# Altium schematic sheet ExternalConnections.SchDoc
size Letter
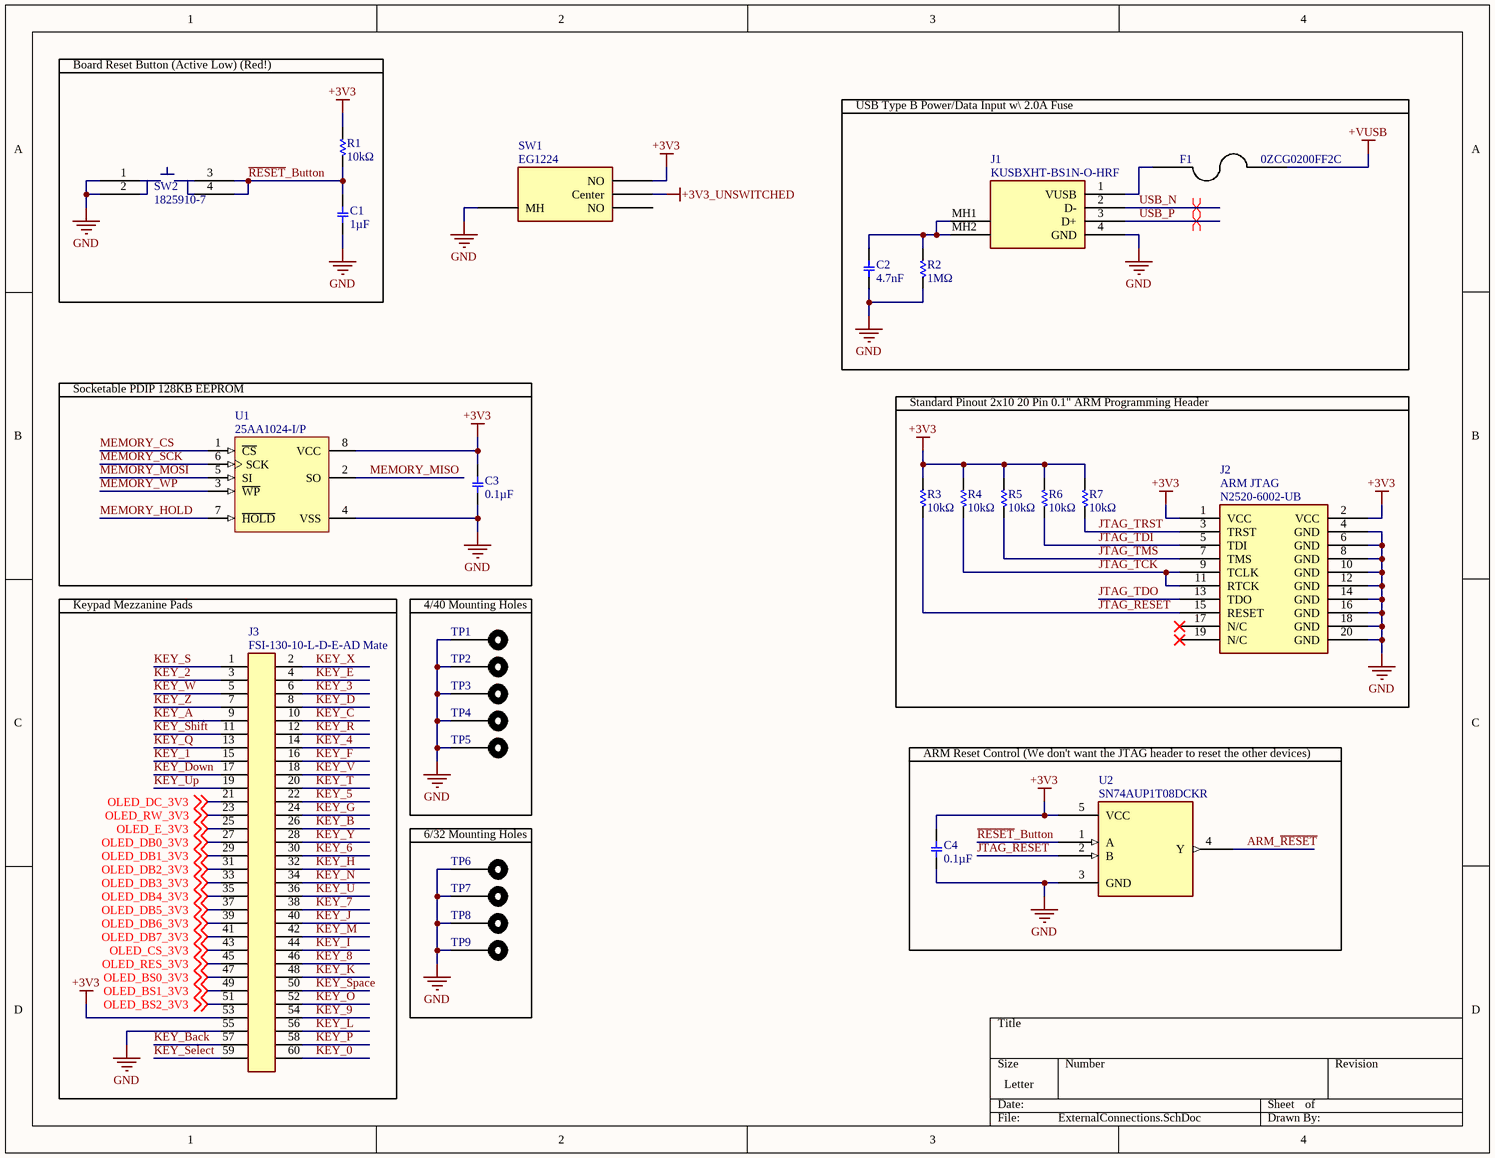
[diagram p0: ExternalConnections.SchDoc]

## Parts
C1  1µF  [C0805(2012)_NP_med]
C2  4.7nF  [C0805(2012)_NP_med]
C3  0.1µF  [C0805(2012)_NP_med]
C4  0.1µF  [C0805(2012)_NP_med]
F1  Manufacturer Part Number: 0ZCG0200FF2C  [C1812(4532)_NP_med]  (hidden comment: Bel 0ZCG0200FF2C)
J1  KUSBXHT-BS1N-O-HRF  [Kycon KUSBXHT-BS1N-O-HRF]
J2  ARM JTAG  Manufacturer Part Number: N2520-6002-UB  [3M 2520-6002UB]
J3  FSI-130-10-L-D-E-AD Mate  [FSI-130-10-L-D-E-AD - Mate]  (no BOM)
R1  10kΩ  [R0805(2012)_med]
R2  1MΩ  [R0805(2012)_med]
R3  10kΩ  [R0805(2012)_med]
R4  10kΩ  [R0805(2012)_med]
R5  10kΩ  [R0805(2012)_med]
R6  10kΩ  [R0805(2012)_med]
R7  10kΩ  [R0805(2012)_med]
SW1  Manufacturer Part Number: EG1224  [E-Switch EG1224]  (hidden comment: E-Switch EG1224)
SW2  1825910-7  [TE 1825910-6]
TP1  Testpoint  [4-40 HOLE]  (value not drawn)
TP2  Testpoint  [4-40 HOLE]  (value not drawn)
TP3  Testpoint  [4-40 HOLE]  (value not drawn)
TP4  Testpoint  [4-40 HOLE]  (value not drawn)
TP5  Testpoint  [4-40 HOLE]  (value not drawn)
TP6  Testpoint  [6-32 Hole]  (value not drawn)
TP7  Testpoint  [6-32 Hole]  (value not drawn)
TP8  Testpoint  [6-32 Hole]  (value not drawn)
TP9  Testpoint  [6-32 Hole]  (value not drawn)
U1  25AA1024-I/P  [PDIP300-P8]
U2  Manufacturer Part Number: SN74AUP1T08DCKR  [TI 5 Pin DCK (R-PDSO-G5)]  (hidden comment: TI SN74AUP1T08DCKR)

## Blocks framed on the sheet
Board Reset Button (Active Low) (Red!): C1 R1 SW2
USB Type B Power/Data Input w\ 2.0A Fuse: C2 F1 J1 R2
Socketable PDIP 128KB EEPROM: C3 U1
Standard Pinout 2x10 20 Pin 0.1" ARM Programming Header: J2 R3-R7
Keypad Mezzanine Pads: J3
4/40 Mounting Holes: TP1-TP5
6/32 Mounting Holes: TP6-TP9

## Nets
+3V3: C3.1 C4.1 J2.1(VCC) J2.2(VCC) J3.53 R1.1 R3.1 R4.1 R5.1 R6.1 R7.1 SW1.1(NO) U1.8(VCC) U2.5(VCC)
+3V3_UNSWITCHED: SW1.2(Center)
+VUSB: F1.2
GND: C1.2 C2.2 C3.2 C4.2 J1.4(GND) J2.4(GND) J2.6(GND) J2.8(GND) J2.10(GND) J2.12(GND) J2.14(GND) J2.16(GND) J2.18(GND) J2.20(GND) J3.55 R2.2 SW1.4(MH) SW2.1 SW2.2 TP1.1 TP2.1 TP3.1 TP4.1 TP5.1 TP6.1 TP7.1 TP8.1 TP9.1 U1.4(VSS) U2.3(GND)
ARM_~{RESET}: U2.4(Y)
JTAG_~{RESET}: J2.15(RESET) R3.2 U2.2(B)
JTAG_TCK: J2.9(TCLK) J2.11(RTCK) R4.2
JTAG_TDI: J2.5(TDI) R6.2
JTAG_TDO: J2.13(TDO)
JTAG_TMS: J2.7(TMS) R5.2
JTAG_TRST: J2.3(TRST) R7.2
KEY_0: J3.60
KEY_1: J3.15
KEY_2: J3.3
KEY_3: J3.6
KEY_4: J3.14
KEY_5: J3.22
KEY_6: J3.30
KEY_7: J3.38
KEY_8: J3.46
KEY_9: J3.54
KEY_A: J3.9
KEY_B: J3.26
KEY_Back: J3.57
KEY_C: J3.10
KEY_D: J3.8
KEY_Down: J3.17
KEY_E: J3.4
KEY_F: J3.16
KEY_G: J3.24
KEY_H: J3.32
KEY_I: J3.44
KEY_J: J3.40
KEY_K: J3.48
KEY_L: J3.56
KEY_M: J3.42
KEY_N: J3.34
KEY_O: J3.52
KEY_P: J3.58
KEY_Q: J3.13
KEY_R: J3.12
KEY_S: J3.1
KEY_Select: J3.59
KEY_Shift: J3.11
KEY_Space: J3.50
KEY_T: J3.20
KEY_U: J3.36
KEY_Up: J3.19
KEY_V: J3.18
KEY_W: J3.5
KEY_X: J3.2
KEY_Y: J3.28
KEY_Z: J3.7
MEMORY_CS: U1.1(~{CS})
MEMORY_HOLD: U1.7(~{HOLD})
MEMORY_MISO: U1.2(SO)
MEMORY_MOSI: U1.5(SI)
MEMORY_SCK: U1.6(SCK)
MEMORY_WP: U1.3(~{WP})
OLED_BS0_3V3: J3.47 ; off-sheet OLED_BS0_3V3
OLED_BS1_3V3: J3.49 ; off-sheet OLED_BS1_3V3
OLED_BS2_3V3: J3.51 ; off-sheet OLED_BS2_3V3
OLED_CS_3V3: J3.43 ; off-sheet OLED_CS_3V3
OLED_DB0_3V3: J3.27 ; off-sheet OLED_DB0_3V3
OLED_DB1_3V3: J3.29 ; off-sheet OLED_DB1_3V3
OLED_DB2_3V3: J3.31 ; off-sheet OLED_DB2_3V3
OLED_DB3_3V3: J3.33 ; off-sheet OLED_DB3_3V3
OLED_DB4_3V3: J3.35 ; off-sheet OLED_DB4_3V3
OLED_DB5_3V3: J3.37 ; off-sheet OLED_DB5_3V3
OLED_DB6_3V3: J3.39 ; off-sheet OLED_DB6_3V3
OLED_DB7_3V3: J3.41 ; off-sheet OLED_DB7_3V3
OLED_DC_3V3: J3.21 ; off-sheet OLED_DC_3V3
OLED_E_3V3: J3.25 ; off-sheet OLED_E_3V3
OLED_RES_3V3: J3.45 ; off-sheet OLED_RES_3V3
OLED_RW_3V3: J3.23 ; off-sheet OLED_RW_3V3
~{RESET}_Button: C1.1 R1.2 SW2.3 SW2.4 U2.1(A)
USB_N: J1.2(D-)
USB_P: J1.3(D+)
NetC2_1: C2.1 J1.MH1 J1.MH2 R2.1
NetF1_1: F1.1 J1.1(VUSB)

Not connected (* = marked no-connect by the designer): J2 17(N/C)* 19(N/C)*; SW1 3(NO)

## Layout directives
differential pair: USB_N, USB_P

## Notes on the sheet
- ARM Reset Control (We don't want the JTAG header to reset the other devices)

## Library data of the parts
C1-C4 = CPN_SMT: SMT Capacitor; Tolerance: X7R; Rating: 16v
  C1: Value: 1µF
  C2: Value: 4.7nF
  C3 C4: Value: 0.1µF
F1 = Bel 0ZCG0200FF2C: PTC RESTTBLE 2.0A 8V CHIP 1812; Manufacturer: Bel Fuse Inc.; Current - Max: 100A; Current - Hold (Ih) (Max): 2A; Current - Trip (It): 3.5A; R Min/Max: 0.020 ~ 0.070 Ohm; Time to Trip: 2s; Supplier 1: Digi-Key; RoHS: RoHS Compliant; Category: Circuit Protection; Stock 1: 4721; Pricing 1: 1=0.18, 10=0.169, 25=0.156, 100=0.1401, 250=0.12476, 500=0.10396, 1000=0.09851 (USD); Packaging: Cut Tape (CT); Voltage - Max: 8V; Package / Case: 1812 (4532 Metric), Concave; ComponentLink1URL: http://www.belfuse.com/pdfs/0ZCG.pdf; ComponentLink1Description: http://www.belfuse.com/pdfs/0ZCG.pdf; Supplier Part Number 1: 507-1777-1-ND
J1 = Kycon KUSBXHT-BS1N-O-HRF: TYPE B ORANGE HIGH TEMP/RETENTION; Manufacturer: Kycon; Connector Type: USB Type B Receptacle; Current Rating: 1 A; Gender: Female; Mounting Angle: Right; Number of Contacts: 4 Contact; Voltage Rating: 30 VAC; Number of Ports: 1 Port; Insulation Resistance: 1000 MOhms; Supplier 1: Mouser; Manufacturer Part Number: KUSBXHT-BS1N-O-HRF; RoHS: RoHS Compliant; Category: USB Connectors; Stock 1: 2882; Pricing 1: 1=2.06, 25=1.73, 100=1.51, 500=1.34, 1000=1.20, 5000=1.11, 10000=1.02 (USD); Color: Orange; Contact Plating: Gold; Operating Temperature Range: - 25 C to + 80 C; Packaging: Tray; Product: USB Type B Connectors; Series: KUSBXHT; Termination Style: Solder; Brand: Kycon; Contact Material: Phosphor Bronze; Flammability Rating: UL 94 V-0; Insulator Color: Orange; Product Category: USB Connectors; Standard: USB; Standard Pack Qty: 36; RoHS - Mouser: Y; Minimum Order Quantity: 1; Reeling: False; ComponentLink1URL: http://www.mouser.com/ds/2/222/KUSBX-371999.pdf; ComponentLink1Description: http://www.mouser.com/ds/2/222/KUSBX-371999.pdf
J2 = 20-Pin ARM JTAG Programming Header: Standard 20-Pin Pinout; Manufacturer: 3M; Connector Type: Header, Shrouded; Number of Positions: 20; Number of Positions Loaded: All; Pitch: 0.100" (2.54mm); Supplier 1: Digi-Key; RoHS: RoHS Compliant; Category: Connectors, Interconnects; Stock 1: 0; Pricing 1: 1008=2.059 (USD); Packaging: Bulk; Contact Type: Male Pin; Number of Rows: 2; Row Spacing: 0.100" (2.54mm); Contact Mating Length: 0.243" (6.17mm); Mounting Type: Through Hole; Termination: Solder; Fastening Type: -; Features: -; Contact Finish: Gold; Contact Finish Thickness: 30µin (0.76µm); Color: Black; ComponentLink1URL: http://multimedia.3m.com/mws/mediawebserver?66666UuZjcFSLXTtMXM6MxfcEVuQEcuZgVs6EVs6E666666--; ComponentLink1Description: http://multimedia.3m.com/mws/mediawebserver?66666UuZjcFSLXTtMXM6MxfcEVuQEcuZgVs6EVs6E666666--
J3 = Samtec FSI-130-10-L-D-E-AD Mate: CONN INTERFACE ONE PC 1MM 60POS
R1-R7 = RES_SMT: SMT resistor; Tolerance: 1%
  R1 R3-R7: Value: 10kΩ
  R2: Value: 1MΩ
SW1 = E-Switch EG1224: SWITCH SLIDE SPDT 500MA 15V; Contact Timing: Non-Shorting (BBM); Switch Function: On-On; Current Rating: 500mA (DC); Actuator Type: Standard; Actuator Length: 8.50mm; Switch Travel: 4.00mm; Operating Force: 250gf; Supplier 1: Digi-Key; Manufacturer: E-Switch; RoHS: RoHS Compliant; Category: Switches; Stock 1: 3595; Pricing 1: 1=0.73, 10=0.698, 25=0.684, 50=0.6112, 100=0.582, 250=0.56744, 500=0.48016, 1000=0.4656 (USD); Packaging: Bulk; Circuit: SPDT; Voltage Rating - AC: -; Voltage Rating - DC: 15V; Contact Material: Copper Alloy; Contact Finish: Silver; Mounting Type: Through Hole, Right Angle; Termination Style: PC Pin; Features: -; Actuator Material: -; Operating Temperature: -20°C ~ 70°C; Mechanical Life: -; Electrical Life: -; ComponentLink1URL: http://spec_sheets.e-switch.com/specs/P040042.pdf; ComponentLink1Description: http://spec_sheets.e-switch.com/specs/P040042.pdf; Supplier Part Number 1: EG2585-ND
SW2 = TE 1825910-6: SWITCH TACTILE SPST-NO 0.05A 24V; Manufacturer: TE Connectivity Alcoswitch Switches; Switch Function: Off-Mom; Contact Rating @ Voltage: 0.05A @ 24VDC; Actuator Type: Standard; Actuator Height off PCB, from Pins: 5.00mm; Actuator Orientation: Top Actuated; Outline: 6.00mm x 6.00mm; Illumination: Non-Illuminated; Operating Force: 160gf; Actuator Material: Polybutylene Terephthalate (PBT); Switch Travel: 0.25mm; Mechanical Life: 100,000 Cycles; Supplier 1: Digi-Key; Manufacturer Part Number: 1825910-6; RoHS: RoHS Compliant; Category: Switches; Stock 1: 68158; Pricing 1: 1=0.11, 25=0.1012, 50=0.0912, 100=0.0869, 250=0.08028, 500=0.07698, 1000=0.06268, 2000=0.05609, 5000=0.05278 (USD); Packaging: Bulk; Circuit: SPST-NO; Mounting Type: Through Hole; Termination Style: PC Pin; Illumination Voltage (Nominal): -; Illumination Type, Color: -; Ingress Protection: -; Features: -; Operating Temperature: -35°C ~ 85°C; ComponentLink1URL: http://www.te.com/commerce/DocumentDelivery/DDEController?Action=srchrtrv&DocNm=1825910&DocType=Customer+Drawing&DocLang=English; ComponentLink1Description: http://www.te.com/commerce/DocumentDelivery/DDEController?Action=srchrtrv&DocNm=1825910&DocType=Customer+Drawing&DocLang=English
U1 = 25AA1024-I/P: 1 Mbit SPI Bus Serial EEPROM, 8-Pin PDIP, Industrial Temperature; Manufacturer: Microchip; DatasheetVersion: revF, May-2008; PackageVersion: revBB, Aug-2009; PackageReference: PDIP300-P8; PackageDescription: 8-Lead Plastic Dual In-Line (P) - 300 mil Body [PDIP]; Supplier 1: Digi-Key; Supplier Part Number 1: 25AA1024-I/P-ND; Supplier 2: Farnell; Supplier Part Number 2: 1548441; Supplier 3: Newark; Supplier Part Number 3: 89H3144; Supplier 4: Mouser; Supplier Part Number 4: 579-25AA1024-I/P; Mounting Technology: Through Hole; Code_JEDEC: MS-001; PartNumber: 25AA1024-I/P; ComponentLink1Description: Manufacturer URL; ComponentLink1URL: http://www.microchip.com/; ComponentLink2Description: Datasheet; ComponentLink2URL: http://ww1.microchip.com/downloads/en/DeviceDoc/21836F.pdf; ComponentLink3Description: Package Specification; ComponentLink3URL: http://www.microchip.com/stellent/groups/techpub_sg/documents/packagingspec/en012702.pdf
U2 = TI SN74AUP1T08DCKR: IC GATE AND 1CH 2-INP SC-70-5; Manufacturer: Texas Instruments; Logic Type: AND Gate; Number of Circuits: 1; Number of Inputs: 2; Voltage - Supply: 2.3 V ~ 3.6 V; Current - Quiescent (Max): 0.5µA; Current - Output High, Low: 4mA, 4mA; Logic Level - Low: 0.35 V ~ 0.5 V; Logic Level - High: 1.1 V ~ 1.19 V; Max Propagation Delay @ V, Max CL: 4.4ns @ 3.3V, 30pF; Supplier 1: Digi-Key; RoHS: RoHS Compliant; Category: Integrated Circuits (ICs); Stock 1: 3783; Pricing 1: 1=0.36, 10=0.29, 100=0.198, 500=0.1482, 1000=0.111 (USD); Packaging: Cut Tape (CT); Features: Schmitt Trigger; Operating Temperature: -40°C ~ 85°C; Mounting Type: Surface Mount; Supplier Device Package: SC-70-5; Package / Case: 5-TSSOP, SC-70-5, SOT-353; ComponentLink1URL: http://www.ti.com/lit/ds/symlink/sn74aup1t08.pdf; ComponentLink1Description: http://www.ti.com/lit/ds/symlink/sn74aup1t08.pdf; Supplier Part Number 1: 296-27391-1-ND